# EAGLE design adafruit_rgblcdshield (EAGLE 9.6.2)
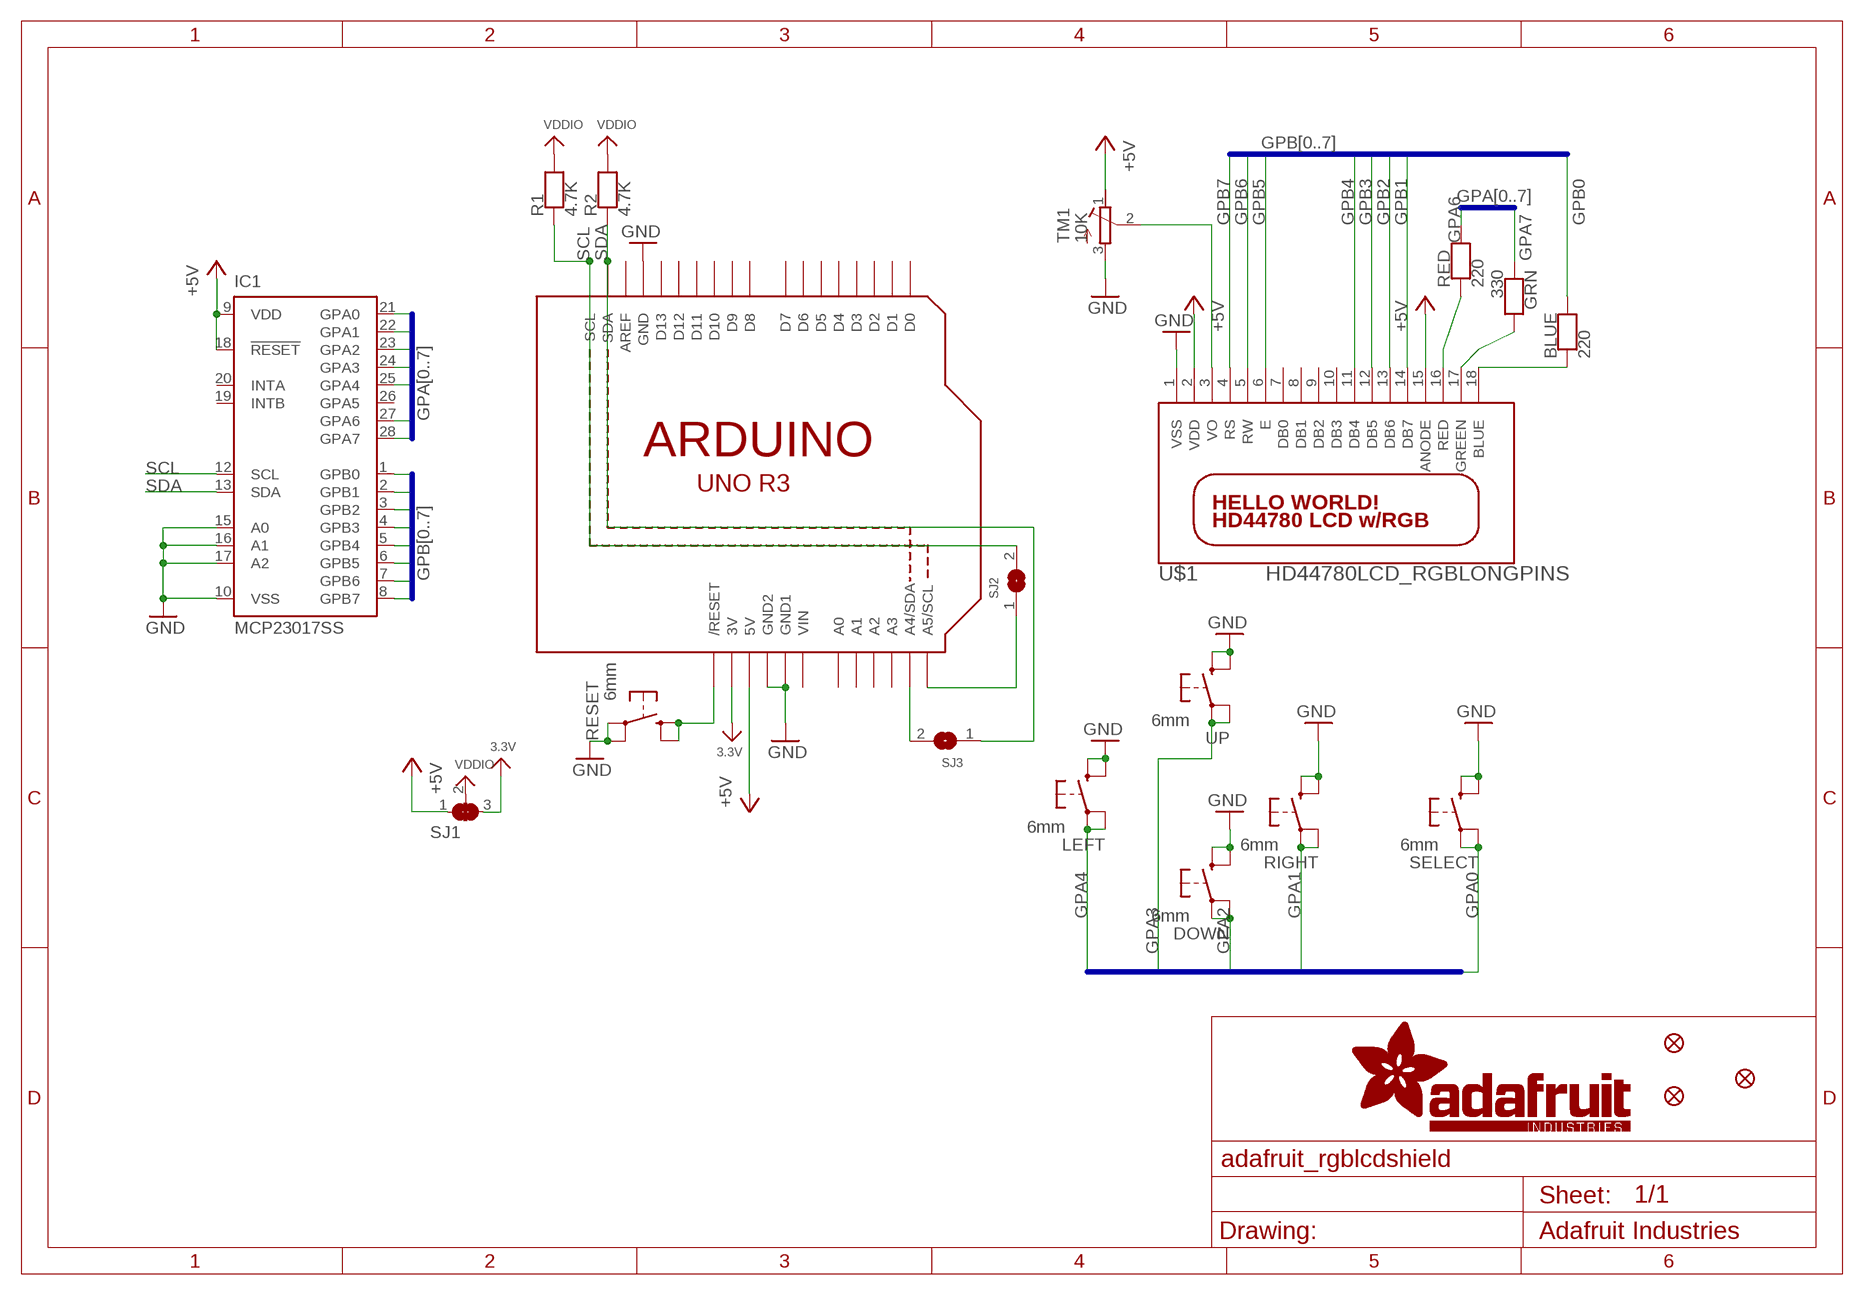
[diagram p0: schematic, sheet 1]

## Parts
BLUE  220  RESISTOR0805_NOOUTLINE  [0805-NO]
DOWN  6mm  SWITCH_TACT_SMT_6MM  [6MMX6MM_TACTILE_SMT]
FID1  FIDUCIAL_1MM  [FIDUCIAL_1MM]
FID2  FIDUCIAL_1MM  [FIDUCIAL_1MM]
FID3  FIDUCIAL_1MM  [FIDUCIAL_1MM]
GRN  330  RESISTOR0805_NOOUTLINE  [0805-NO]
IC1  MCP23017SS  [SSOP28]
LEFT  6mm  SWITCH_TACT_SMT_6MM  [6MMX6MM_TACTILE_SMT]
R1  4.7K  RESISTOR0805_NOOUTLINE  [0805-NO]
R2  4.7K  RESISTOR0805_NOOUTLINE  [0805-NO]
RED  220  RESISTOR0805_NOOUTLINE  [0805-NO]
RESET  6mm  SWITCH_TACT_SMT_6MM  [6MMX6MM_TACTILE_SMT]
RIGHT  6mm  SWITCH_TACT_SMT_6MM  [6MMX6MM_TACTILE_SMT]
SELECT  6mm  SWITCH_TACT_SMT_6MM  [6MMX6MM_TACTILE_SMT]
SJ1  SOLDERJUMPER_2WAY  [SOLDERJUMPER_2WAY_OPEN_NOPASTE]
SJ2  SOLDERJUMPER  [SOLDERJUMPER_ARROW_NOPASTE]
SJ3  SOLDERJUMPER  [SOLDERJUMPER_ARROW_NOPASTE]
TM1  10K  R-TRIMM3314J  [RTRIM3314J]
U1  ARDUINOR3-NOIOREF-NOTEXT  [ARDUINOR3-NOTEXT-NOIOREF]
U$1  HD44780LCD_RGBLONGPINS  [LCD1602-RGB]
UP  6mm  SWITCH_TACT_SMT_6MM  [6MMX6MM_TACTILE_SMT]

## Nets
3.3V: SJ1.3 U1.3V
+5V: IC1.9(VDD) IC1.18(!RESET) SJ1.1 TM1.1(E) U1.5V U$1.2(VDD) U$1.15(ANODE)
GND: DOWN.B'(S1) DOWN.B(S) IC1.10(VSS) IC1.15(A0) IC1.16(A1) IC1.17(A2) LEFT.B'(S1) LEFT.B(S) RESET.A'(P1) RESET.A(P) RIGHT.B'(S1) RIGHT.B(S) SELECT.B'(S1) SELECT.B(S) TM1.3(A) U1.GND U1.GND1 U1.GND2 U$1.1(VSS) UP.B'(S1) UP.B(S)
GPA0: IC1.21(GPA0) SELECT.A'(P1) SELECT.A(P)
GPA1: IC1.22(GPA1) RIGHT.A'(P1) RIGHT.A(P)
GPA2: DOWN.A'(P1) DOWN.A(P) IC1.23(GPA2)
GPA3: IC1.24(GPA3) UP.A'(P1) UP.A(P)
GPA4: IC1.25(GPA4) LEFT.A'(P1) LEFT.A(P)
GPA6: IC1.27(GPA6) RED.2
GPA7: GRN.1 IC1.28(GPA7)
GPB0: BLUE.2 IC1.1(GPB0)
GPB1: IC1.2(GPB1) U$1.14(DB7)
GPB2: IC1.3(GPB2) U$1.13(DB6)
GPB3: IC1.4(GPB3) U$1.12(DB5)
GPB4: IC1.5(GPB4) U$1.11(DB4)
GPB5: IC1.6(GPB5) U$1.6(E)
GPB6: IC1.7(GPB6) U$1.5(RW)
GPB7: IC1.8(GPB7) U$1.4(RS)
N$2: BLUE.1 U$1.18(BLUE)
N$3: GRN.2 U$1.17(GREEN)
N$4: RED.1 U$1.16(RED)
N$5: TM1.2(S) U$1.3(VO)
N$6: SJ3.2 U1.A4(A4/SDA)
N$7: SJ2.1 U1.A5(A5/SCL)
RESET: RESET.B'(S1) RESET.B(S) U1.RESET(/RESET)
SCL: IC1.12(SCL) R1.1 SJ2.2 U1.SCL
SDA: IC1.13(SDA) R2.1 SJ3.1 U1.SDA
VDDIO: R1.2 R2.2 SJ1.2
Unconnected: IC1.19(INTB) IC1.20(INTA) IC1.26(GPA5) U1.A0 U1.A1 U1.A2 U1.A3 U1.AREF U1.D0 U1.D1 U1.D2 U1.D3 U1.D4 U1.D5 U1.D6 U1.D7 U1.D8 U1.D9 U1.D10 U1.D11 U1.D12 U1.D13 U$1.7(DB0) U$1.8(DB1) U$1.9(DB2) U$1.10(DB3)

## Buses
GPB[0..7]
GPA[0..7]

## Power pins joined to a net without a drawn wire
VIN: U1.VIN

## Library data of the parts
BLUE GRN R1 R2 RED = microbuilder:RESISTOR: Resistors For new designs, use the packages preceded by an '_' character since they are more reliable: The following footprints should be used on most boards: _0402 - Standard footprint for regular board layouts _0603 - Standard footprint for regular board layouts _0805 - Standard footprint for regular board layouts _1206 - Standard footprint for regular board layouts For extremely tight-pitch boards where space is at a premium, the following 'micro-pitch' footprints can be used (smaller pads, no silkscreen outline, etc.): _0402MP - Micro-pitch footprint for very dense/compact boards _0603MP - Micro-pitch footprint for very dense/compact boards _0805MP - Micro-pitch footprint for very dense/compact boards _1206MP - Micro-pitch footprint for very dense/compact boards
DOWN LEFT RESET RIGHT SELECT UP = adafruit_electromech:SWITCH_TACT_SMT: SMT Tact Switches RKB2 https://www.digikey.com/short/m027prz5
FID1-FID3 = microbuilder:FIDUCIAL: Fiducial Alignment Points Various fiducial points for machine vision alignment.; BOM: EXCLUDE
IC1 = adafruit:MCP23017: http://ww1.microchip.com/downloads/en/DeviceDoc/21952a.pdf Source: http://ww1.microchip.com/downloads/en/DeviceDoc/21952a.pdf
SJ1 = microbuilder:SOLDERJUMPER_2WAY: 2-Way Solder Jumper
SJ2 SJ3 = microbuilder:SOLDERJUMPER: SMD Solder JUMPER Solder the two pads together to create a connection, or remove the solder to break it. REFLOW - Use this footprint for solder paste and reflow ovens. WAVE - Use this footprint for hand-soldering (larger pads). CLOSED - Has a trace between the two pads to ensure it is closed by default. The trace needs to be cut to disable the jumper, and can be closed again by creating a solder bridge between the two pads.; BOM: EXCLUDE
TM1 = adafruit_electromech:R-TRIMM: Trimm resistor; SPICEMODEL: X; SPICEPREFIXL: POT
U1 = adafruit:ARDUINOR3-NOIOREF
U$1 = adafruit:HD44780LCD_RGB

## Board
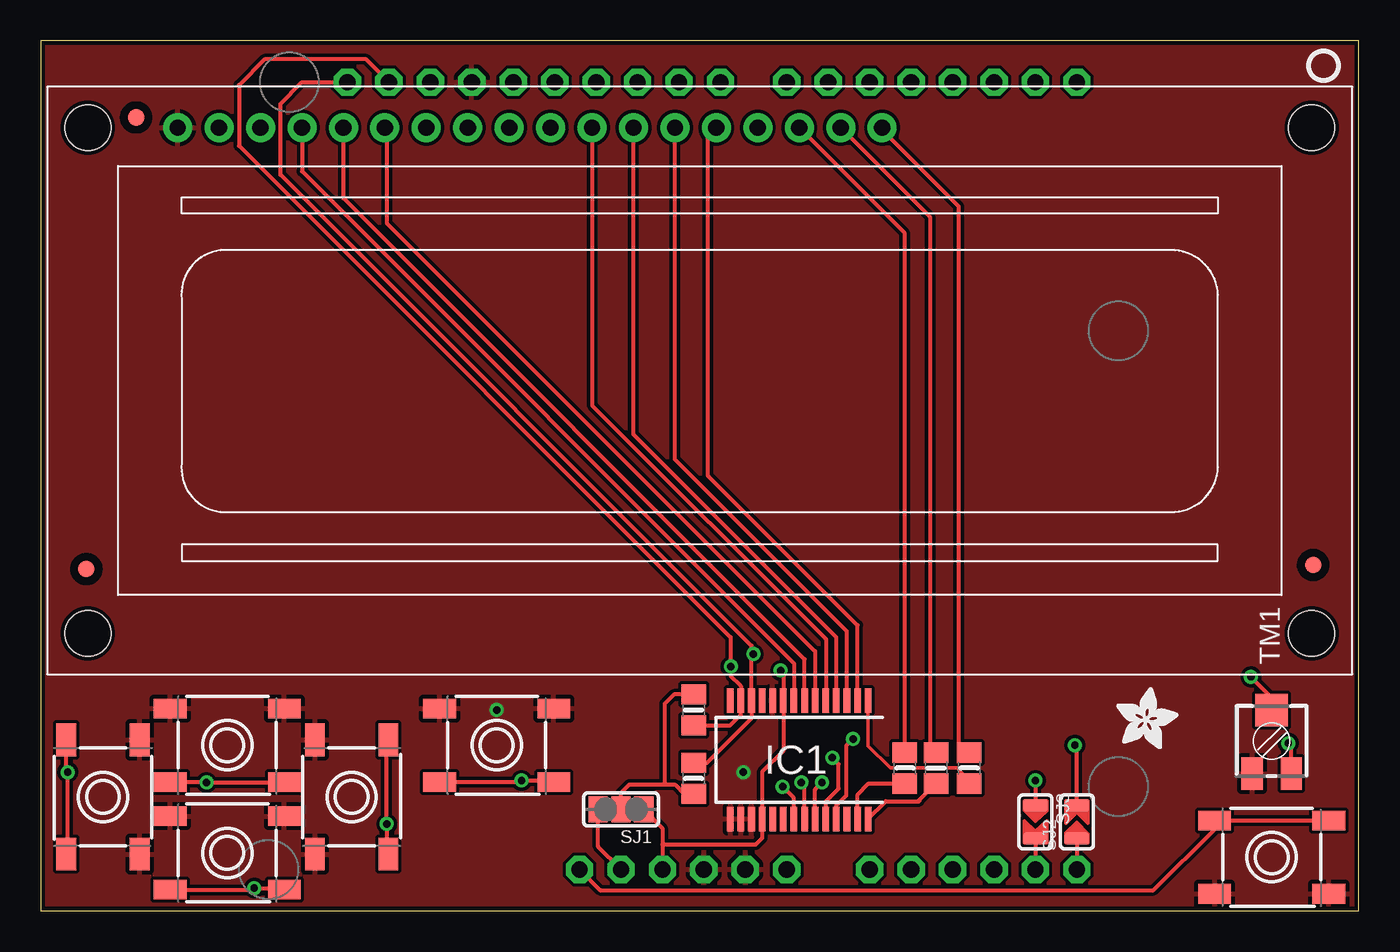
[diagram p1: board, top side]
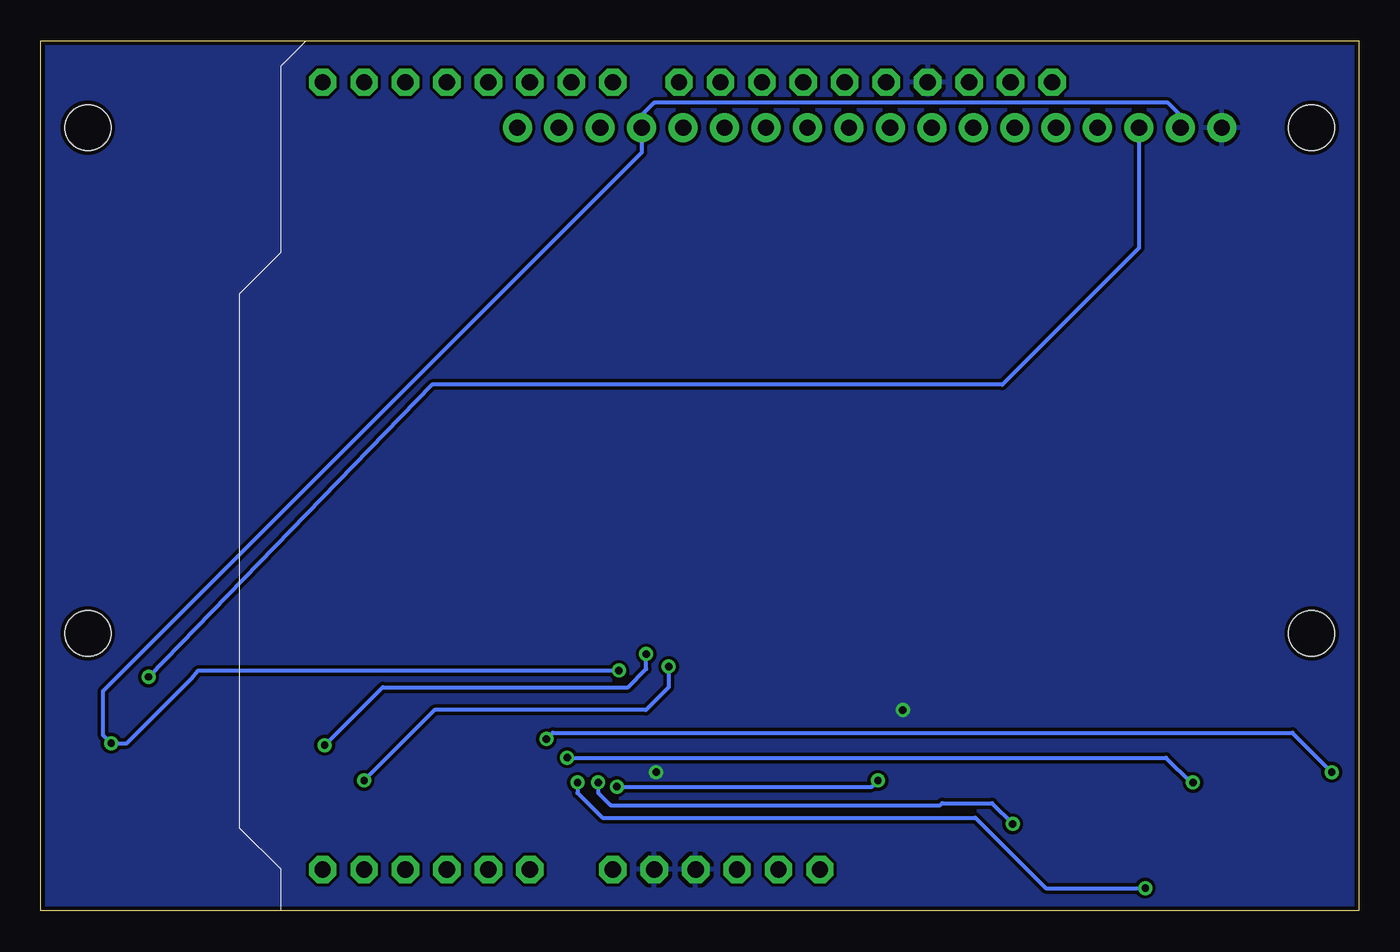
[diagram p2: board, bottom side, seen from below]

Size 80.77 x 53.34 mm. Coordinates in mm from the lower left corner, seen from the top.
Outline: 0,0 80.77,0 80.77,53.34 0,53.34 0,0
Copper layers (1*16): Top 0.035mm / dielectric 1.5mm / Bottom 0.035mm
Design rules "adafruit 8-8": minimum track width 6mil, minimum drill 15.5mil, track to track 8mil, track to pad 8mil, pad to pad 8mil, via to via 8mil, smd to smd 8mil, copper to edge 10mil, drill to drill 8mil, minimum pad ring 10mil, minimum via ring 8mil, stop-mask expansion 2mil, vias tented up to drill 20mil, thermal gap 10mil

### Footprints (pad centres in the part's own frame; a part is rotated, then mirrored left to right if it is on the bottom)
0805-NO = smd 1.24 x 1.5: 1 -0.95,0; 2 0.95,0
6MMX6MM_TACTILE_SMT = smd 2 x 1.2: A -3.5,-2.25; A' 3.5,-2.25; B -3.5,2.25; B' 3.5,2.25
FIDUCIAL_1MM = smd 1 x 1: 1 0,0
SSOP28 = smd 0.4 x 1.5: 1 -4.225,-3.625; 2 -3.575,-3.625; 3 -2.925,-3.625; 4 -2.275,-3.625; 5 -1.625,-3.625; 6 -0.975,-3.625; 7 -0.325,-3.625; 8 0.325,-3.625; 9 0.975,-3.625; 10 1.625,-3.625; 11 2.275,-3.625; 12 2.925,-3.625; 13 3.575,-3.625; 14 4.225,-3.625; 15 4.225,3.625; 16 3.575,3.625; 17 2.925,3.625; 18 2.275,3.625; 19 1.625,3.625; 20 0.975,3.625; 21 0.325,3.625; 22 -0.325,3.625; 23 -0.975,3.625; 24 -1.625,3.625; 25 -2.275,3.625; 26 -2.925,3.625; 27 -3.575,3.625; 28 -4.225,3.625
SOLDERJUMPER_2WAY_OPEN_NOPASTE = smd 1.168 x 1.6: 1 -1.397,0; 2 0,0; 3 1.397,0
SOLDERJUMPER_ARROW_NOPASTE = smd 0.762 x 1.524: 1 -1.016,0; 2 1.016,0
RTRIM3314J = smd 1.3 x 2: 1 1.2,-2; 3 -1.2,-2 | smd 2 x 2: 2 0,1.9
ARDUINOR3-NOTEXT-NOIOREF = drill 1 pad 1.676 octagon: 3V 35.56,2.54; 5V 38.1,2.54; A0 50.8,2.54; A1 53.34,2.54; A2 55.88,2.54; A3 58.42,2.54; A4 60.96,2.54; A5 63.5,2.54; AREF 23.876,50.8; D0 63.5,50.8; D1 60.96,50.8; D2 58.42,50.8; D3 55.88,50.8; D4 53.34,50.8; D5 50.8,50.8; D6 48.26,50.8; D7 45.72,50.8; D8 41.656,50.8; D9 39.116,50.8; D10 36.576,50.8; D11 34.036,50.8; D12 31.496,50.8; D13 28.956,50.8; GND 26.416,50.8; GND1 43.18,2.54; GND2 40.64,2.54; RESET 33.02,2.54; SCL 18.796,50.8; SDA 21.336,50.8; VIN 45.72,2.54
LCD1602-RGB = drill 1 pad 1.778: 1 -32,15.5; 2 -29.46,15.5; 3 -26.92,15.5; 4 -24.38,15.5; 5 -21.84,15.5; 6 -19.3,15.5; 7 -16.76,15.5; 8 -14.22,15.5; 9 -11.68,15.5; 10 -9.14,15.5; 11 -6.6,15.5; 12 -4.06,15.5; 13 -1.52,15.5; 14 1.02,15.5; 15 3.56,15.5; 16 6.1,15.5; 17 8.64,15.5; 18 11.18,15.5 | hole 2.8: -37.5,-15.5; -37.5,15.5; 37.5,15.5; 37.5,-15.5

### Placement (x,y rotation side)
BLUE  56.9,8.76 270 top
DOWN  11.43,3.56 0 top
E$1  [PCBFEAT-REV-040]  78.61,51.82 0 top
FID1  2.79,20.95 0 top
FID2  5.84,48.64 0 top
FID3  77.98,21.21 0 top
GRN  54.86,8.76 90 top
IC1  46.48,9.27 180 top
LEFT  3.81,6.99 270 top
PLABEL1  [PLABEL1]  0.89,51.05 0 top
PLABEL2  [PLABEL2]  65.91,51.05 0 top
PLABEL3  [PLABEL3]  63.5,8.13 0 top
PLABEL4  [PLABEL4]  35.56,4.32 0 top
PLABEL5  [PLABEL5]  34.04,8.51 90 top
PLABEL6  [PLABEL6]  36.96,8.51 90 top
PLABEL7  [PLABEL7]  59.18,5.46 90 top
PLABEL8  [PLABEL8]  65.28,5.33 90 top
PLABEL9  [PLABEL9]  16,12.57 0 top
PLABEL10  [PLABEL10]  0.25,0.25 0 top
PLABEL11  [PLABEL11]  2.03,11.81 0 top
PLABEL12  [PLABEL12]  16.38,0.64 0 top
PLABEL13  [PLABEL13]  24.64,5.08 0 top
PLABEL14  [PLABEL14]  66.04,2.29 0 top
PLABEL15  [PLABEL15]  79.38,6.99 90 top
R1  40.01,8.13 270 top
R2  40.01,12.32 90 top
RED  52.96,8.76 270 top
RESET  75.44,3.3 0 top
RIGHT  19.05,6.99 90 top
SELECT  27.94,10.16 0 top
SJ1  35.56,6.22 180 top
SJ2  63.5,5.46 90 top
SJ3  60.96,5.46 270 top
TM1  75.44,10.41 0 top
U1  0,0 0 top
U$1  40.39,32.51 0 top
U$4  [ADAFRUIT_3.5MM]  65.91,9.91 0 top
UP  11.43,10.16 0 top

### Tracks (layer width: path | path; a pad name or v marks a point on that pad's centre or on a via)
3.3V
  Top 0.254: U1.3V 34.16,3.94 SJ1.3
+5V  (via drill 0.45)
  Top 0.254: SJ1.1 38.1,5.08 38.1,4.06 | 38.1,4.06 U1.5V | 38.1,4.06 43.81,4.06 44.21,4.46 IC1.18 44.21,8.52 45.51,9.82 IC1.9 45.51,14.56 v45.34,14.73 | TM1.1 76.64,10.1 v76.45,10.29
  Bottom 0.254: U$1.2 10.93,48.77 11.68,49.53 43.18,49.53 43.95,48.76 U$1.15 43.95,46.49 76.96,13.47 76.96,10.79 v76.45,10.29 75.5,10.29 71.54,14.26 71.12,14.73 v45.34,14.73
GND  (via drill 0.45)
  other vias: 43.05,8.51 27.94,12.32
  pour Top: 0,53.34 0,0 81.03,0 81.03,53.34
  pour Bottom: 0,53.34 0,0 81.03,0 81.03,53.34
GPA0  (via drill 0.45)
  Top 0.254: IC1.21 46.16,6.93 45.66,7.43 v45.47,7.62 | v29.46,8 29.59,8 | 29.59,8 31.35,8 SELECT.A' | SELECT.A 29.5,7.91 29.59,8 | v45.47,7.62
  Bottom 0.254: v45.47,7.62 29.84,7.62 v29.46,8
GPA1  (via drill 0.45)
  Top 0.254: IC1.22 46.81,7.68 v46.61,7.87 | RIGHT.A 21.21,3.58 v21.21,5.33 21.21,10.39 RIGHT.A'
  Bottom 0.254: v46.61,7.87 46.61,7.24 45.85,6.48 25.65,6.48 25.53,6.6 22.48,6.6 v21.21,5.33
GPA2  (via drill 0.45)
  Top 0.254: IC1.23 47.46,7.45 v47.88,7.87 | DOWN.A' 14.84,1.4 v13.08,1.4 12.99,1.31 DOWN.A
  Bottom 0.254: v47.88,7.87 47.88,7.24 46.35,5.71 23.5,5.71 19.18,1.4 v13.08,1.4
GPA3  (via drill 0.45)
  Top 0.254: IC1.24 48.11,6.71 48.9,7.49 48.9,9.02 v48.51,9.4 | UP.A 7.97,7.87 v10.16,7.87 14.89,7.87 UP.A'
  Bottom 0.254: v48.51,9.4 11.81,9.4 10.29,7.87 v10.16,7.87
GPA4  (via drill 0.45)
  Top 0.254: IC1.25 48.76,6.47 49.35,7.06 49.35,10.11 v49.78,10.54 | LEFT.A 1.56,8.6 v1.65,8.51 1.65,3.58 LEFT.A'
  Bottom 0.254: v49.78,10.54 49.4,10.92 4.06,10.92 v1.65,8.51
GPA6
  Top 0.254: IC1.27 50.06,7.13 50.74,7.81 RED.2
GPA7
  Top 0.254: IC1.28 51.79,6.73 53.85,6.73 53.85,6.8 GRN.1
GPB0
  Top 0.203: BLUE.2 56.9,8 56.13,8.76 52.07,8.76 50.71,10.13 IC1.1
GPB1
  Top 0.254: IC1.2 50.06,17.51 40.89,26.67 40.89,47.5 U$1.14
GPB2
  Top 0.254: IC1.3 49.41,17.14 38.87,27.68 U$1.13
GPB3
  Top 0.254: IC1.4 48.76,16.77 36.33,29.21 U$1.12
GPB4
  Top 0.254: U$1.11 33.79,30.98 48.11,16.66 IC1.5
GPB5
  Top 0.254: U$1.6 21.21,47.89 21.21,42.16 47.46,15.92 IC1.6
GPB6
  Top 0.254: IC1.7 46.81,15.42 18.55,43.68 U$1.5
GPB7
  Top 0.254: U$1.4 16.01,45.34 46.16,15.18 IC1.8
N$1
  Top 0.254: 36.07,6.22 36.45,6.22
N$2
  Top 0.254: U$1.18 51.57,47.88 56.27,43.19 56.27,10.34 BLUE.1
N$3
  Top 0.254: U$1.17 54.49,42.55 54.49,10.09 GRN.2
N$4
  Top 0.254: RED.1 52.96,41.54 U$1.16
N$5  (via drill 0.45)
  Top 0.254: TM1.2 75.44,13.08 v74.17,14.35
  Bottom 0.254: U$1.3 13.47,40.64 21.84,32.26 56.8,32.26 v74.17,14.35
N$6
  Top 0.254: SJ3.2 U1.A4
N$7
  Top 0.254: SJ2.1 U1.A5
RESET
  Top 0.254: U1.RESET 34.29,1.27 68.2,1.27 71.94,5.01 RESET.B RESET.B'
SCL  (via drill 0.45)
  Top 0.254: R1.1 40.83,9.08 43.56,11.81 IC1.12 43.56,15.75 | 43.56,15.75 43.56,16.26 14.69,45.13 14.69,49.48 16,50.8 U1.SCL | SJ2.2 63.5,10.03 v63.37,10.16 | v43.66,15.75 43.56,15.75
  Bottom 0.254: v63.37,10.16 59.82,13.72 44.77,13.72 43.66,14.82 v43.66,15.75
SDA  (via drill 0.45)
  Top 0.254: R2.1 42.23,11.37 42.91,12.05 IC1.13 42.91,13.79 42.27,14.42 42.27,14.99 | U1.SDA 19.94,52.2 13.72,52.2 12.14,50.63 12.14,46.91 42.27,16.78 42.27,14.99 | v60.96,8 SJ3.1 | v42.29,14.99 42.27,14.99
  Bottom 0.254: v42.29,14.99 42.29,13.72 43.69,12.32 56.64,12.32 v60.96,8
VDDIO
  Top 0.254: SJ1.2 35.56,7.24 36.07,7.75 38.23,7.75 | 38.23,7.75 38.86,7.75 39.43,7.18 R1.2 | R2.2 38.8,13.27 38.23,12.7 38.23,7.75

### Text on the board
Pinguin_tBackup: i2c 16x2 RGB | LCD shield | Left | Up | 3V | 5V | adafruit! | Contrast | Contrast | Select | SDA | SCL | Vio | Reset | Down | Right